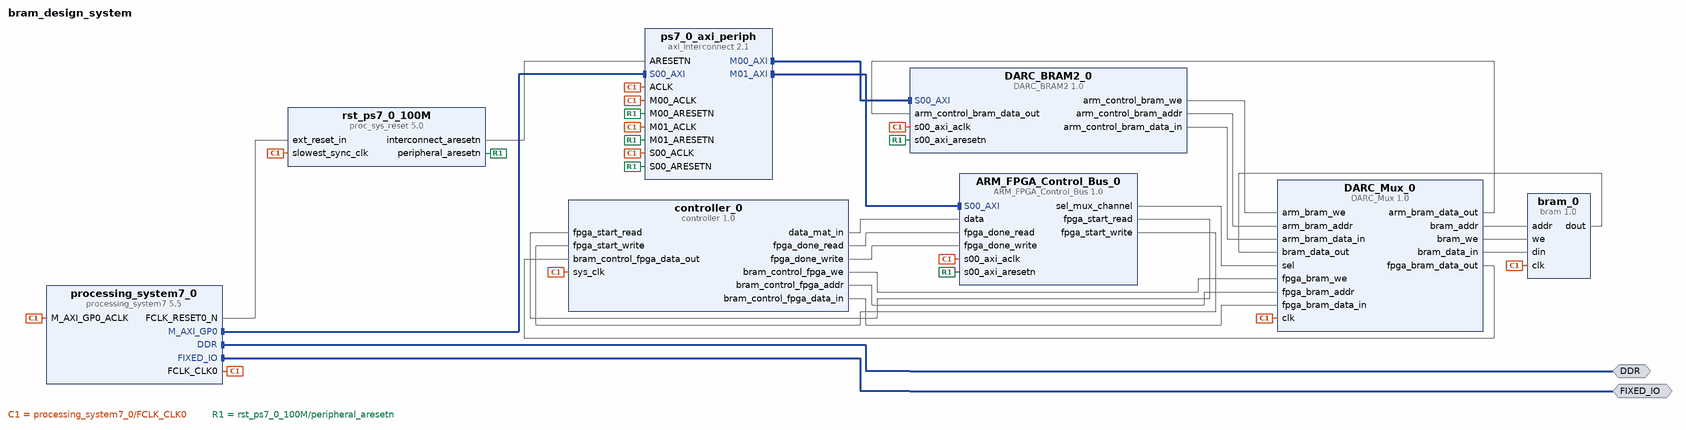
[diagram p0: block diagram of the top level]
# Vivado block design bram_design_system, xc7z020clg484-1, Vivado 2016.3
create_bd_design bram_design_system

create_bd_intf_port -mode Master -vlnv xilinx.com:interface:ddrx_rtl:1.0 DDR
create_bd_intf_port -mode Master -vlnv xilinx.com:display_processing_system7:fixedio_rtl:1.0 FIXED_IO

create_bd_cell -type ip -vlnv xilinx.com:ip:processing_system7:5.5 processing_system7_0
set_property -dict {CONFIG.preset ZedBoard} [get_bd_cells processing_system7_0]
create_bd_cell -type ip -vlnv xilinx.com:ip:axi_interconnect:2.1 ps7_0_axi_periph
set_property -dict {CONFIG.NUM_MI 2} [get_bd_cells ps7_0_axi_periph]
create_bd_cell -type ip -vlnv xilinx.com:ip:proc_sys_reset:5.0 rst_ps7_0_100M
create_bd_cell -type ip -vlnv xilinx.com:user:DARC_BRAM2:1.0 DARC_BRAM2_0
create_bd_cell -type ip -vlnv xilinx.com:user:DARC_Mux:1.0 DARC_Mux_0
create_bd_cell -type ip -vlnv xilinx.com:user:controller:1.0 controller_0
create_bd_cell -type ip -vlnv xilinx.com:user:bram:1.0 bram_0
create_bd_cell -type ip -vlnv xilinx.com:user:ARM_FPGA_Control_Bus:1.0 ARM_FPGA_Control_Bus_0

# ---- connections ----

connect_bd_intf_net [get_bd_intf_pins processing_system7_0/M_AXI_GP0] [get_bd_intf_pins ps7_0_axi_periph/S00_AXI]
connect_bd_intf_net [get_bd_intf_pins ps7_0_axi_periph/M00_AXI] [get_bd_intf_pins DARC_BRAM2_0/S00_AXI]
connect_bd_intf_net [get_bd_intf_pins ps7_0_axi_periph/M01_AXI] [get_bd_intf_pins ARM_FPGA_Control_Bus_0/S00_AXI]
connect_bd_intf_net [get_bd_intf_ports DDR] [get_bd_intf_pins processing_system7_0/DDR]
connect_bd_intf_net [get_bd_intf_ports FIXED_IO] [get_bd_intf_pins processing_system7_0/FIXED_IO]
connect_bd_net [get_bd_pins processing_system7_0/FCLK_CLK0] \
  [get_bd_pins processing_system7_0/M_AXI_GP0_ACLK] [get_bd_pins rst_ps7_0_100M/slowest_sync_clk] \
  [get_bd_pins DARC_BRAM2_0/s00_axi_aclk] [get_bd_pins ps7_0_axi_periph/S00_ACLK] [get_bd_pins ps7_0_axi_periph/ACLK] \
  [get_bd_pins ps7_0_axi_periph/M00_ACLK] [get_bd_pins DARC_Mux_0/clk] [get_bd_pins bram_0/clk] \
  [get_bd_pins controller_0/sys_clk] [get_bd_pins ARM_FPGA_Control_Bus_0/s00_axi_aclk] \
  [get_bd_pins ps7_0_axi_periph/M01_ACLK]
connect_bd_net [get_bd_pins processing_system7_0/FCLK_RESET0_N] [get_bd_pins rst_ps7_0_100M/ext_reset_in]
connect_bd_net [get_bd_pins rst_ps7_0_100M/peripheral_aresetn] \
  [get_bd_pins DARC_BRAM2_0/s00_axi_aresetn] [get_bd_pins ps7_0_axi_periph/S00_ARESETN] \
  [get_bd_pins ps7_0_axi_periph/M00_ARESETN] [get_bd_pins ARM_FPGA_Control_Bus_0/s00_axi_aresetn] \
  [get_bd_pins ps7_0_axi_periph/M01_ARESETN]
connect_bd_net [get_bd_pins rst_ps7_0_100M/interconnect_aresetn] [get_bd_pins ps7_0_axi_periph/ARESETN]
connect_bd_net [get_bd_pins DARC_Mux_0/bram_addr] [get_bd_pins bram_0/addr]
connect_bd_net [get_bd_pins DARC_Mux_0/bram_we] [get_bd_pins bram_0/we]
connect_bd_net [get_bd_pins DARC_Mux_0/bram_data_in] [get_bd_pins bram_0/din]
connect_bd_net [get_bd_pins bram_0/dout] [get_bd_pins DARC_Mux_0/bram_data_out]
connect_bd_net [get_bd_pins DARC_Mux_0/fpga_bram_data_out] [get_bd_pins controller_0/bram_control_fpga_data_out]
connect_bd_net [get_bd_pins DARC_Mux_0/arm_bram_data_out] [get_bd_pins DARC_BRAM2_0/arm_control_bram_data_out]
connect_bd_net [get_bd_pins DARC_BRAM2_0/arm_control_bram_we] [get_bd_pins DARC_Mux_0/arm_bram_we]
connect_bd_net [get_bd_pins DARC_BRAM2_0/arm_control_bram_addr] [get_bd_pins DARC_Mux_0/arm_bram_addr]
connect_bd_net [get_bd_pins DARC_BRAM2_0/arm_control_bram_data_in] [get_bd_pins DARC_Mux_0/arm_bram_data_in]
connect_bd_net [get_bd_pins controller_0/bram_control_fpga_we] [get_bd_pins DARC_Mux_0/fpga_bram_we]
connect_bd_net [get_bd_pins controller_0/bram_control_fpga_addr] [get_bd_pins DARC_Mux_0/fpga_bram_addr]
connect_bd_net [get_bd_pins controller_0/bram_control_fpga_data_in] [get_bd_pins DARC_Mux_0/fpga_bram_data_in]
connect_bd_net [get_bd_pins controller_0/data_mat_in] [get_bd_pins ARM_FPGA_Control_Bus_0/data]
connect_bd_net [get_bd_pins ARM_FPGA_Control_Bus_0/sel_mux_channel] [get_bd_pins DARC_Mux_0/sel]
connect_bd_net [get_bd_pins ARM_FPGA_Control_Bus_0/fpga_start_read] [get_bd_pins controller_0/fpga_start_read]
connect_bd_net [get_bd_pins ARM_FPGA_Control_Bus_0/fpga_start_write] [get_bd_pins controller_0/fpga_start_write]
connect_bd_net [get_bd_pins controller_0/fpga_done_read] [get_bd_pins ARM_FPGA_Control_Bus_0/fpga_done_read]
connect_bd_net [get_bd_pins controller_0/fpga_done_write] [get_bd_pins ARM_FPGA_Control_Bus_0/fpga_done_write]

# ---- address map ----
assign_bd_address -offset 0x43C00000 -range 64K -target_address_space [get_bd_addr_spaces processing_system7_0/Data] [get_bd_addr_segs DARC_BRAM2_0/S00_AXI/S00_AXI_reg]
assign_bd_address -offset 0x43C10000 -range 64K -target_address_space [get_bd_addr_spaces processing_system7_0/Data] [get_bd_addr_segs ARM_FPGA_Control_Bus_0/S00_AXI/S00_AXI_reg]

validate_bd_design
save_bd_design
